# Altium schematic sheet [09] - Power.SchDoc: =ProjectName
size A4; CheckedBy: Ven; Author: Ven; CompanyName: HUST; Revision: V.1.0
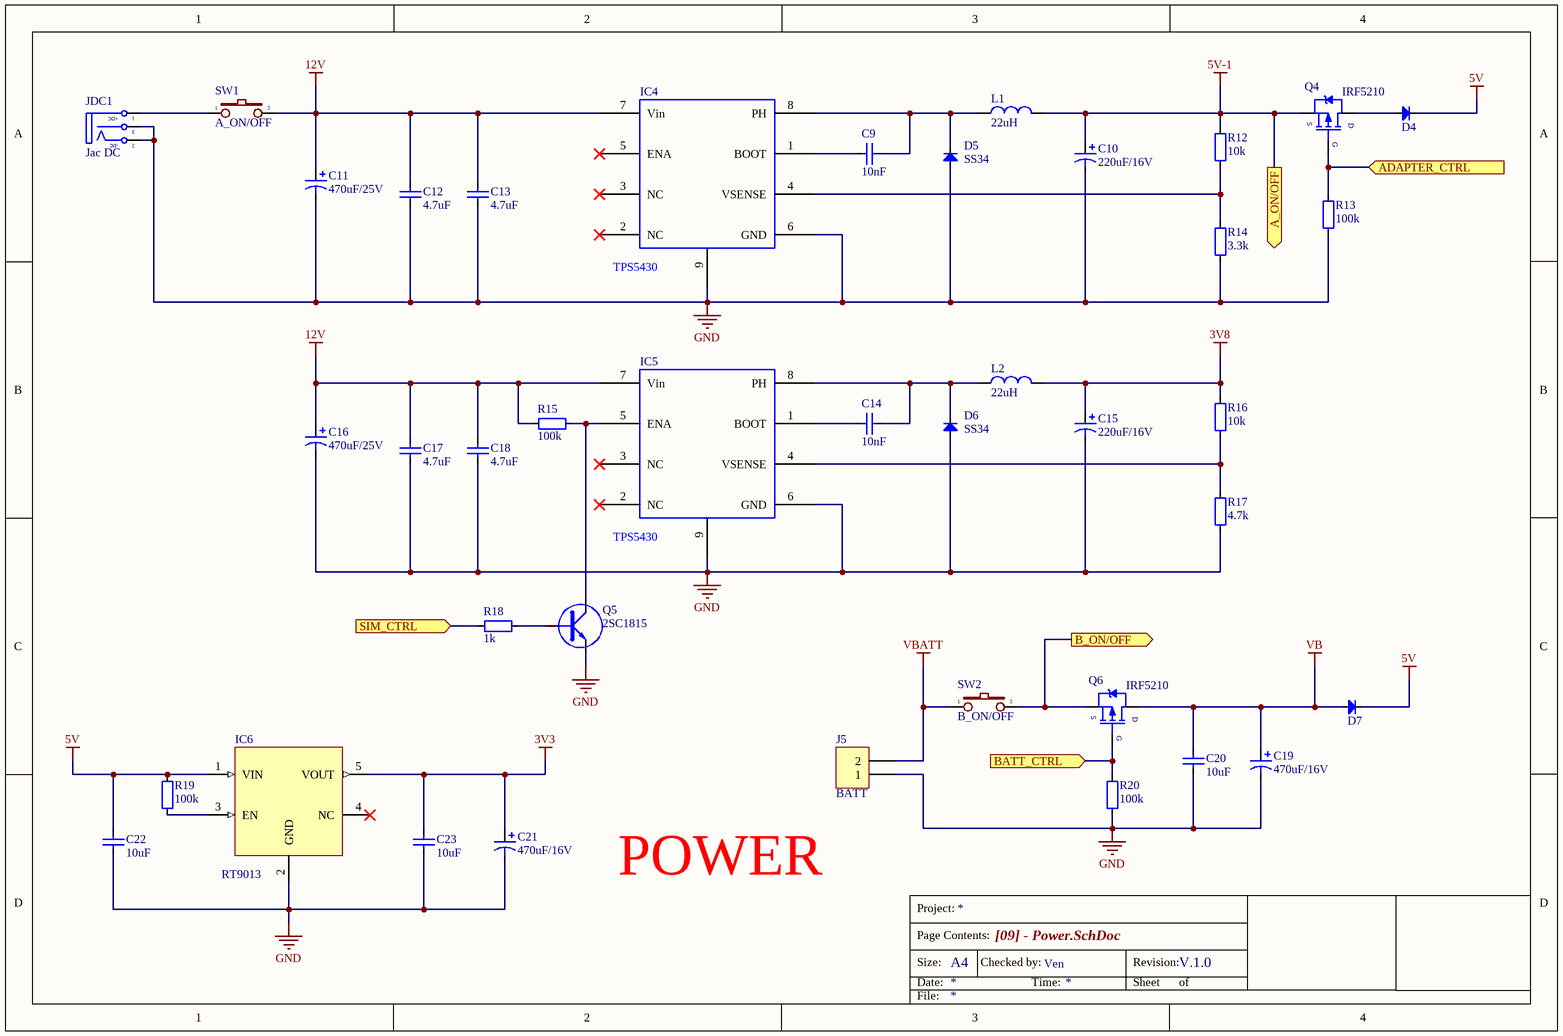
[diagram p0: [09] - Power.SchDoc]

## Parts
C9  10nF  [CAP_0805]
C10  220uF/16V  [C8mm]
C11  470uF/25V  [C8mm]
C12  4.7uF  [CAP_0805]
C13  4.7uF  [CAP_0805]
C14  10nF  [CAP_0805]
C15  220uF/16V  [C8mm]
C16  470uF/25V  [C8mm]
C17  4.7uF  [CAP_0805]
C18  4.7uF  [CAP_0805]
C19  470uF/16V  [C8mm]
C20  10uF  [CAP_0805]
C21  470uF/16V  [C8mm]
C22  10uF  [CAP_0805]
C23  10uF  [CAP_0805]
D4  SS34  [DO-214AC(SMA)]  (value not drawn)
D5  SS34  [DO-214AC(SMA)]
D6  SS34  [DO-214AC(SMA)]
D7  SS34  [DO-214AC(SMA)]  (value not drawn)
IC4  TPS5430  [TPS5430-2]
IC5  TPS5430  [TPS5430-2]
IC6  RT9013  [SOT23-5]
J5  BATT  [KF2-5.08]
JDC1  Jac DC  [DC-IN]
L1  22uH  [L-SMD-M-7.3x4.5]
L2  22uH  [L-SMD-M-7.3x4.5]
Q4  IRF5210  [TO-220]
Q5  2SC1815  [SOT23]
Q6  IRF5210  [TO-220]
R12  10k  [RES-SMD-0805]
R13  100k  [RES-SMD-0805]
R14  3.3k  [RES-SMD-0805]
R15  100k  [RES-SMD-0805]
R16  10k  [RES-SMD-0805]
R17  4.7k  [RES-SMD-0805]
R18  1k  [RES-SMD-0805]
R19  100k  [RES-SMD-0805]
R20  100k  [RES-SMD-0805]
SW1  A_ON/OFF  [SW2]
SW2  B_ON/OFF  [SW2]

## Ports
A_ON/OFF (out), ADAPTER_CTRL (in), B_ON/OFF (out), BATT_CTRL (in), SIM_CTRL (in)

## Nets
3V3: C21.1 C23.2 IC6.5(VOUT)
3V8: C15.1 L2.2 R16.2
5V: C22.2 D4.2(K) D7.2(K) IC6.1(VIN) R19.1
5V-1: C10.1 L1.2 Q4.3(S) R12.2 ; port A_ON/OFF
12V: C11.1 C12.2 C13.2 C16.1 C17.2 C18.2 IC4.7(Vin) IC5.7(Vin) R15.1 SW1.2
GND: C10.2 C11.2 C12.1 C13.1 C15.2 C16.2 C17.1 C18.1 C19.2 C20.1 C21.2 C22.1 C23.1 D5.1(A) D6.1(A) IC4.6(GND) IC4.9(PWR_PAD) IC5.6(GND) IC5.9(PWR_PAD) IC6.2(GND) J5.1 JDC1.2(TN) JDC1.3(S) Q5.3(E) R13.1 R14.1 R17.1 R20.2
VB: C19.1 C20.2 D7.1(A) Q6.2(D)
VBATT: J5.2 SW2.1
ADAPTER_CTRL: Q4.1(G) R13.2 ; port ADAPTER_CTRL
B_ON/OFF: Q6.3(S) SW2.2 ; port B_ON/OFF
BATT_CTRL: Q6.1(G) R20.1 ; port BATT_CTRL
SIM_CTRL: R18.1 ; port SIM_CTRL
NetC9_1: C9.1 D5.2(K) IC4.8(PH) L1.1
NetC9_2: C9.2 IC4.1(BOOT)
NetC14_1: C14.1 D6.2(K) IC5.8(PH) L2.1
NetC14_2: C14.2 IC5.1(BOOT)
NetD4_1: D4.1(A) Q4.2(D)
NetIC4_4: IC4.4(VSENSE) R12.1 R14.2
NetIC5_4: IC5.4(VSENSE) R16.1 R17.2
NetIC5_5: IC5.5(ENA) Q5.2(C) R15.2
NetIC6_3: IC6.3(EN) R19.2
NetJDC1_1: JDC1.1(T) SW1.1
NetQ5_1: Q5.1(B) R18.2

Not connected (* = marked no-connect by the designer): IC4 2(NC)* 3(NC)* 5(ENA)*; IC5 2(NC)* 3(NC)*; IC6 4(NC)*

## Notes on the sheet
- POWER
- Project:
- Page Contents:
- Size:
- Date:
- A4
- Checked by:
- Time:
- Revision:
- Sheet
- of
- File:
- (in symbol DCIN) +DC; -DC

## Library data of the parts
C9 C12-C14 C17 C18 C20 C22 C23 = CapSMD: Capacitor; Value: 33p; Published: 8-Jun-2000; LatestRevisionDate: 17-Jul-2002; LatestRevisionNote: Re-released for DXP Platform.; PackageReference: RAD-0.3; Publisher: Altium Limited
C10 C11 C15 C16 C19 C21 = Cap Pol: Polarized Capacitor (Axial); Published: 8-Jun-2000; LatestRevisionDate: 17-Jul-2002; LatestRevisionNote: Re-released for DXP Platform.; PackageReference: POLAR0.8; Publisher: Altium Limited
D4-D7 = Diode SMD: Diode Schottky 1N5822 3A 40V SMA; Code - JEDEC: DO-214-AB; Value: 1N5007; Published: 8-Jun-2000; Revision: July-2002: Re-released for DXP Platform.; Publisher: Altium Limited
IC6 = RT9013: RT9013-33GB IC REG LINEAR 3.3V 500mA SOT23-5
J5 = KF2: Manufacturer: Würth Elektronik eiSos GmbH; partNo: 691103110002; ComponentLink1 Description: Manufacturer; ComponentLink2 Description: Datasheet; NoPins: 2; Created Date: 29 October 2013; ComponentLink1URL: http://www.we-online.com; ComponentLink2URL: http://katalog.we-online.de/em/datasheet/6911031100xx.pdf; Created by: Karrer Zheng
JDC1 = DCIN: Jac DC input; Value: Jac DC
L1 L2 = Inductor: Value: 150 mH
Q4 Q6 = IRF5210: IR/Vishay P-Channel MOSFET 40A 100V
Q5 = 2SC1815: NPN 600mW, ECB; Value: C1815
R12-R20 = Resistor - SMD: Resistor; Manufacturer: Generic Components; Class: Passive; Published: 08/06/2000; Publisher: Altium Hobart Technology Centre
SW1 SW2 = SW2: Switch button 2 pin; Value: SW chip 2 pin
IC4 IC5 = TPS5430: Name: TPS5430